# EAGLE design fpga (EAGLE 6.6.0)
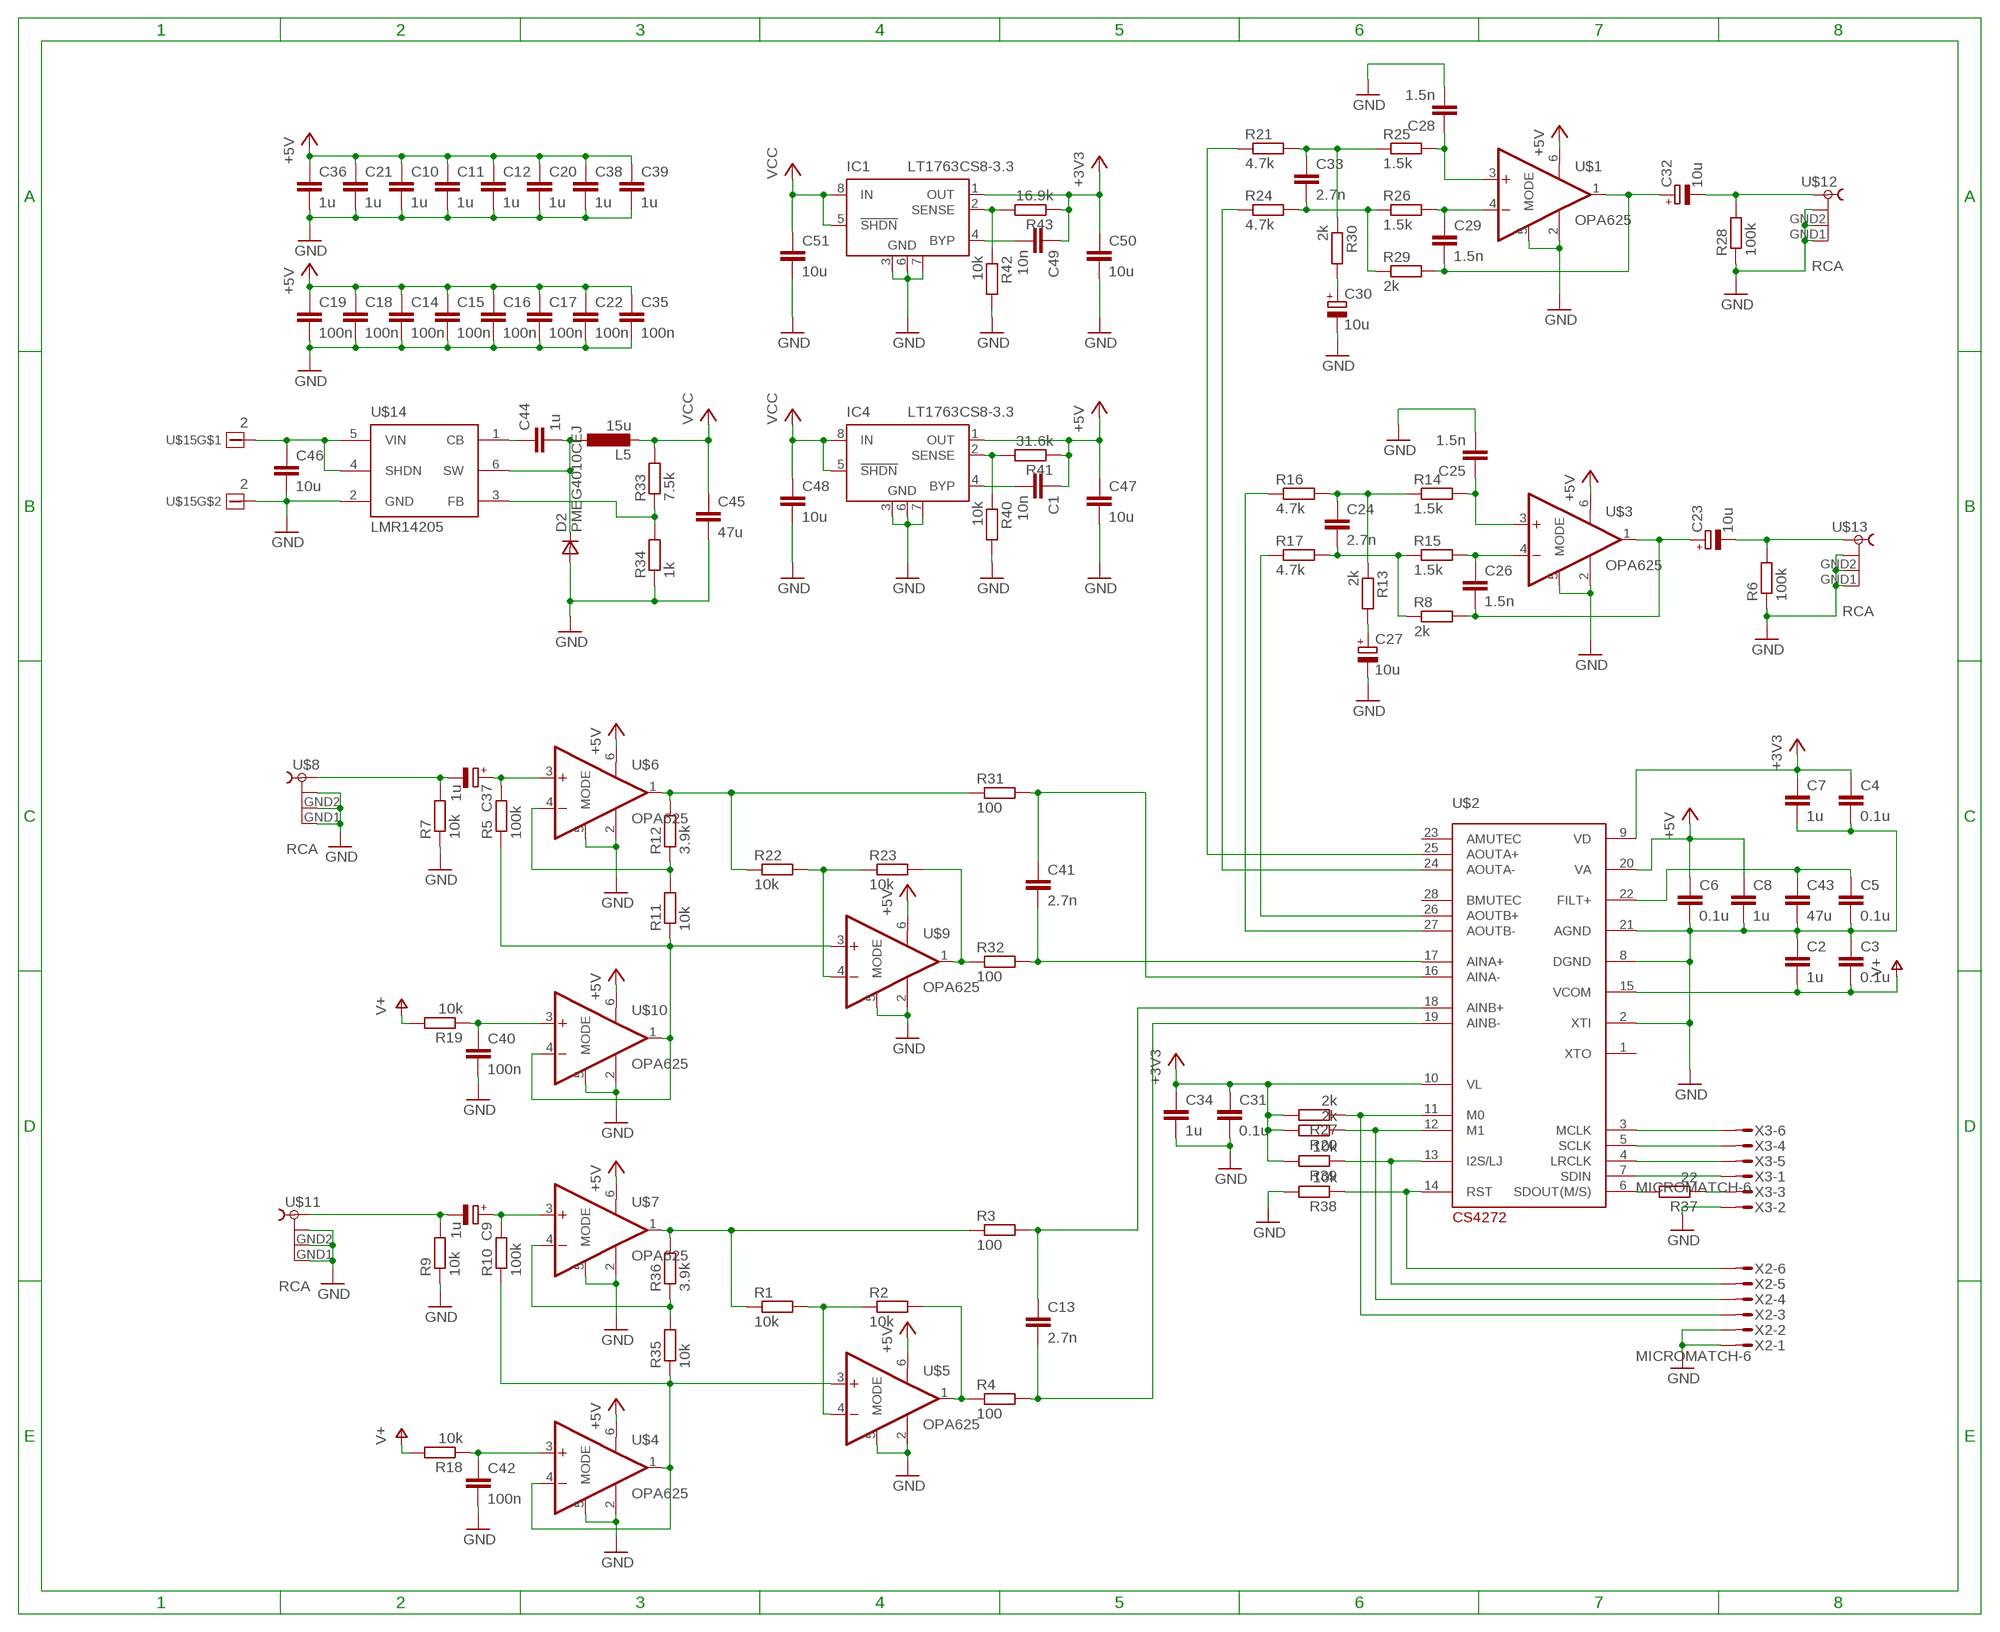
[diagram p0: schematic, sheet 1]

## Parts
C1  10n  C-EUC0603K  [C0603K]
C2  1u  C-EUC0603K  [C0603K]
C3  0.1u  C-EUC0603K  [C0603K]
C4  0.1u  C-EUC0603K  [C0603K]
C5  0.1u  C-EUC0603K  [C0603K]
C6  0.1u  C-EUC0603K  [C0603K]
C7  1u  C-EUC0603K  [C0603K]
C8  1u  C-EUC0603K  [C0603K]
C9  1u  CPOL-EU153CLV-0405  [153CLV-0405]
C10  1u  C-EUC0603K  [C0603K]
C11  1u  C-EUC0603K  [C0603K]
C12  1u  C-EUC0603K  [C0603K]
C13  2.7n  C-EUC0603K  [C0603K]
C14  100n  C-EUC0603K  [C0603K]
C15  100n  C-EUC0603K  [C0603K]
C16  100n  C-EUC0603K  [C0603K]
C17  100n  C-EUC0603K  [C0603K]
C18  100n  C-EUC0603K  [C0603K]
C19  100n  C-EUC0603K  [C0603K]
C20  1u  C-EUC0603K  [C0603K]
C21  1u  C-EUC0603K  [C0603K]
C22  100n  C-EUC0603K  [C0603K]
C23  10u  CPOL-EU153CLV-0405  [153CLV-0405]
C24  2.7n  C-EUC0603K  [C0603K]
C25  1.5n  C-EUC0603K  [C0603K]
C26  1.5n  C-EUC0603K  [C0603K]
C27  10u  CPOL-EU153CLV-0405  [153CLV-0405]
C28  1.5n  C-EUC0603K  [C0603K]
C29  1.5n  C-EUC0603K  [C0603K]
C30  10u  CPOL-EU153CLV-0405  [153CLV-0405]
C31  0.1u  C-EUC0603K  [C0603K]
C32  10u  CPOL-EU153CLV-0405  [153CLV-0405]
C33  2.7n  C-EUC0603K  [C0603K]
C34  1u  C-EUC0603K  [C0603K]
C35  100n  C-EUC0603K  [C0603K]
C36  1u  C-EUC0603K  [C0603K]
C37  1u  CPOL-EU153CLV-0405  [153CLV-0405]
C38  1u  C-EUC0603K  [C0603K]
C39  1u  C-EUC0603K  [C0603K]
C40  100n  C-EUC0603K  [C0603K]
C41  2.7n  C-EUC0603K  [C0603K]
C42  100n  C-EUC0603K  [C0603K]
C43  47u  C-EUC0805  [C0805]
C44  1u  C-EUC0603K  [C0603K]
C45  47u  C-EUC1206  [C1206]
C46  10u  C-EUC0805  [C0805]
C47  10u  C-EUC0603K  [C0603K]
C48  10u  C-EUC0603K  [C0603K]
C49  10n  C-EUC0603K  [C0603K]
C50  10u  C-EUC0603K  [C0603K]
C51  10u  C-EUC0603K  [C0603K]
D2  PMEG4010CEJ  DSOD323  [SOD323]
IC1  LT1763CS8-3.3  [SOIC8]
IC4  LT1763CS8-3.3  [SOIC8]
L5  15u  L-EU  [AAA]
R1  10k  R-EU_R0603  [R0603]
R2  10k  R-EU_R0603  [R0603]
R3  100  R-EU_R0603  [R0603]
R4  100  R-EU_R0603  [R0603]
R5  100k  R-EU_R0603  [R0603]
R6  100k  R-EU_R0603  [R0603]
R7  10k  R-EU_R0603  [R0603]
R8  2k  R-EU_R0603  [R0603]
R9  10k  R-EU_R0603  [R0603]
R10  100k  R-EU_R0603  [R0603]
R11  10k  R-EU_R0603  [R0603]
R12  3.9k  R-EU_R0603  [R0603]
R13  2k  R-EU_R0603  [R0603]
R14  1.5k  R-EU_R0603  [R0603]
R15  1.5k  R-EU_R0603  [R0603]
R16  4.7k  R-EU_R0603  [R0603]
R17  4.7k  R-EU_R0603  [R0603]
R18  10k  R-EU_R0603  [R0603]
R19  10k  R-EU_R0603  [R0603]
R20  2k  R-EU_R0603  [R0603]
R21  4.7k  R-EU_R0603  [R0603]
R22  10k  R-EU_R0603  [R0603]
R23  10k  R-EU_R0603  [R0603]
R24  4.7k  R-EU_R0603  [R0603]
R25  1.5k  R-EU_R0603  [R0603]
R26  1.5k  R-EU_R0603  [R0603]
R27  2k  R-EU_R0603  [R0603]
R28  100k  R-EU_R0603  [R0603]
R29  2k  R-EU_R0603  [R0603]
R30  2k  R-EU_R0603  [R0603]
R31  100  R-EU_R0603  [R0603]
R32  100  R-EU_R0603  [R0603]
R33  7.5k  R-EU_R0603  [R0603]
R34  1k  R-EU_R0603  [R0603]
R35  10k  R-EU_R0603  [R0603]
R36  3.9k  R-EU_R0603  [R0603]
R37  22  R-EU_R0603  [R0603]
R38  10k  R-EU_R0603  [R0603]
R39  10k  R-EU_R0603  [R0603]
R40  10k  R-EU_R0603  [R0603]
R41  31.6k  R-EU_R0603  [R0603]
R42  10k  R-EU_R0603  [R0603]
R43  16.9k  R-EU_R0603  [R0603]
U$1  OPA625  [SOT23-6]
U$2  CS4272  [TSSOP28]
U$3  OPA625  [SOT23-6]
U$4  OPA625  [SOT23-6]
U$5  OPA625  [SOT23-6]
U$6  OPA625  [SOT23-6]
U$7  OPA625  [SOT23-6]
U$8  RCA  [RCA]
U$9  OPA625  [SOT23-6]
U$10  OPA625  [SOT23-6]
U$11  RCA  [RCA]
U$12  RCA  [RCA]
U$13  RCA  [RCA]
U$14  LMR14205  [TSOT23-6_DDC]
U$15  2  [2]
X2  MICROMATCH-6  [MICROMATCH-6]
X3  MICROMATCH-6  [MICROMATCH-6]

## Nets
+3V3: C4.1 C7.1 C31.1 C34.1 C49.1 C50.1 IC1.1(OUT) R20.2 R27.2 R39.2 R43.1 U$2.9(VD) U$2.10(VL)
+5V: C1.1 C6.1 C8.1 C10.1 C11.1 C12.1 C14.1 C15.1 C16.1 C17.1 C18.1 C19.1 C20.1 C21.1 C22.1 C35.1 C36.1 C38.1 C39.1 C47.1 IC4.1(OUT) R41.1 U$1.6(V+) U$2.20(VA) U$3.6(V+) U$4.6(V+) U$5.6(V+) U$6.6(V+) U$7.6(V+) U$9.6(V+) U$10.6(V+)
GND: C2.1 C3.1 C4.2 C5.2 C6.2 C7.2 C8.2 C10.2 C11.2 C12.2 C14.2 C15.2 C16.2 C17.2 C18.2 C19.2 C20.2 C21.2 C22.2 C25.2 C27.- C28.2 C30.- C31.2 C34.2 C35.2 C36.2 C38.2 C39.2 C40.2 C42.2 C43.2 C45.2 C46.2 C47.2 C48.2 C50.2 C51.2 D2.2(A) IC1.3(GND) IC1.6(GND) IC1.7(GND) IC4.3(GND) IC4.6(GND) IC4.7(GND) R6.1 R7.1 R9.1 R28.1 R34.1 R38.2 R40.2 R42.2 U$1.2(V-) U$1.5(MODE) U$2.2(XTI) U$2.8(DGND) U$2.21(AGND) U$3.2(V-) U$3.5(MODE) U$4.2(V-) U$4.5(MODE) U$5.2(V-) U$5.5(MODE) U$6.2(V-) U$6.5(MODE) U$7.2(V-) U$7.5(MODE) U$8.GND1 U$8.GND2 U$8.GND3 U$9.2(V-) U$9.5(MODE) U$10.2(V-) U$10.5(MODE) U$11.GND1 U$11.GND2 U$11.GND3 U$12.GND1 U$12.GND2 U$12.GND3 U$13.GND1 U$13.GND2 U$13.GND3 U$14.2(GND) U$15.P$2 X2.1 X2.2 X3.2
N$1: R10.1 R35.1 U$4.1(OUT) U$4.4(-IN) U$5.3(+IN)
N$2: C9.+ R10.2 U$7.3(+IN)
N$3: R2.2 R4.1 U$5.1(OUT)
N$4: C5.1 C43.1 U$2.22(FILT+)
N$5: R1.2 R2.1 U$5.4(-IN)
N$6: C40.1 R19.1 U$10.3(+IN)
N$7: C24.1 R13.1 R14.1 R16.2
N$8: C13.1 R3.2 U$2.18(AINB+)
N$9: C13.2 R4.2 U$2.19(AINB-)
N$10: R12.2 R22.1 R31.1 U$6.1(OUT)
N$12: C24.2 R8.1 R15.1 R17.2
N$13: C37.- R7.2 U$8.S1
N$14: C9.- R9.2 U$11.S1
N$15: C25.1 R14.2 U$3.3(+IN)
N$16: C26.1 R15.2 U$3.4(-IN)
N$17: C23.+ C26.2 R8.2 U$3.1(OUT)
N$18: C23.- R6.2 U$13.S1
N$19: C27.+ R13.2
N$20: C30.+ R30.2
N$21: C42.1 R18.1 U$4.3(+IN)
N$23: IC1.2(SENSE) R42.1 R43.2
N$24: R17.1 U$2.26(AOUTB+)
N$25: R16.1 U$2.27(AOUTB-)
N$26: C49.2 IC1.4(BYP)
N$27: R24.1 U$2.24(AOUTA-)
N$28: R21.1 U$2.25(AOUTA+)
N$29: C33.1 R21.2 R25.1 R30.1
N$30: R11.2 R12.1 U$6.4(-IN)
N$32: C33.2 R24.2 R26.1 R29.1
N$33: C28.1 R25.2 U$1.3(+IN)
N$34: C29.1 R26.2 U$1.4(-IN)
N$35: C29.2 C32.+ R29.2 U$1.1(OUT)
N$36: R27.1 U$2.11(M0) X2.3
N$37: C41.2 R32.2 U$2.17(AINA+)
N$38: R1.1 R3.1 R36.2 U$7.1(OUT)
N$39: C32.- R28.2 U$12.S1
N$40: R20.1 U$2.12(M1) X2.4
N$41: C37.+ R5.2 U$6.3(+IN)
N$42: R35.2 R36.1 U$7.4(-IN)
N$43: C41.1 R31.2 U$2.16(AINA-)
N$44: R5.1 R11.1 U$9.3(+IN) U$10.1(OUT) U$10.4(-IN)
N$45: C44.1 U$14.1(CB)
N$46: R23.2 R32.1 U$9.1(OUT)
N$47: C44.2 D2.1(C) L5.P$1 U$14.6(SW)
N$48: R22.2 R23.1 U$9.4(-IN)
N$50: R33.1 R34.2 U$14.3(FB)
N$51: R38.1 U$2.14(RST) X2.6
N$52: R39.1 U$2.13(I2S/LJ) X2.5
N$53: U$2.3(MCLK) X3.6
N$54: U$2.5(SCLK) X3.4
N$55: U$2.4(LRCLK) X3.5
N$56: C46.1 U$14.4(SHDN) U$14.5(VIN) U$15.P$1
N$57: U$2.7(SDIN) X3.1
N$58: R37.2 U$2.6(SDOUT(M/S))
N$59: R37.1 X3.3
N$61: IC4.2(SENSE) R40.1 R41.2
N$64: C1.2 IC4.4(BYP)
V+: C2.2 C3.2 R18.2 R19.2 U$2.15(VCOM)
VCC: C45.1 C48.1 C51.1 IC1.5(!SHDN) IC1.8(IN) IC4.5(!SHDN) IC4.8(IN) L5.P$2 R33.2
Unconnected: U$2.1(XTO) U$2.23(AMUTEC) U$2.28(BMUTEC)

## Library data of the parts
C1-C8 C10-C22 C24-C26 C28 C29 C31 C33-C36 C38-C51 = rcl:C-EU: CAPACITOR, European symbol
C9 C23 C27 C30 C32 C37 = rcl:CPOL-EU: POLARIZED CAPACITOR, European symbol
D2 = zetex:D: DIODE; MPN: CDSOD323-T05C; OC_FARNELL: 1824860; OC_NEWARK: 79R6078
IC1 IC4 = linear-technology:LT1763CS8: 500mA, Low Noise, LDO Micropower Regulators Source: http://cds.linear.com/docs/Datasheet/1763ff.pdf; MPN: LT1763CS8-3.3; OC_FARNELL: 1273617; OC_NEWARK: 57M6055
L5 = rcl_COPY:L-EU: INDUCTOR, European symbol
R1-R43 = resistor:R-EU_: RESISTOR, European symbol
U$1 U$3-U$7 U$9 U$10 = linear2:OPA625
U$2 = analog-devices:CS4272
U$8 U$11-U$13 = con-hirschmann_copy:RCA
U$14 = texas_copy:LMR14205
U$15 = con-phoenix-3.81_copy:2
X2 X3 = con-amp-micromatch:MICROMATCH-6: MicroMaTch 6 7-215464-6 / 0-215464-6 Drawing Number C-215464 DDEController.pdf; MPN: 7-215464-6; OC_FARNELL: 3784630; OC_NEWARK: 19R8125

## Board
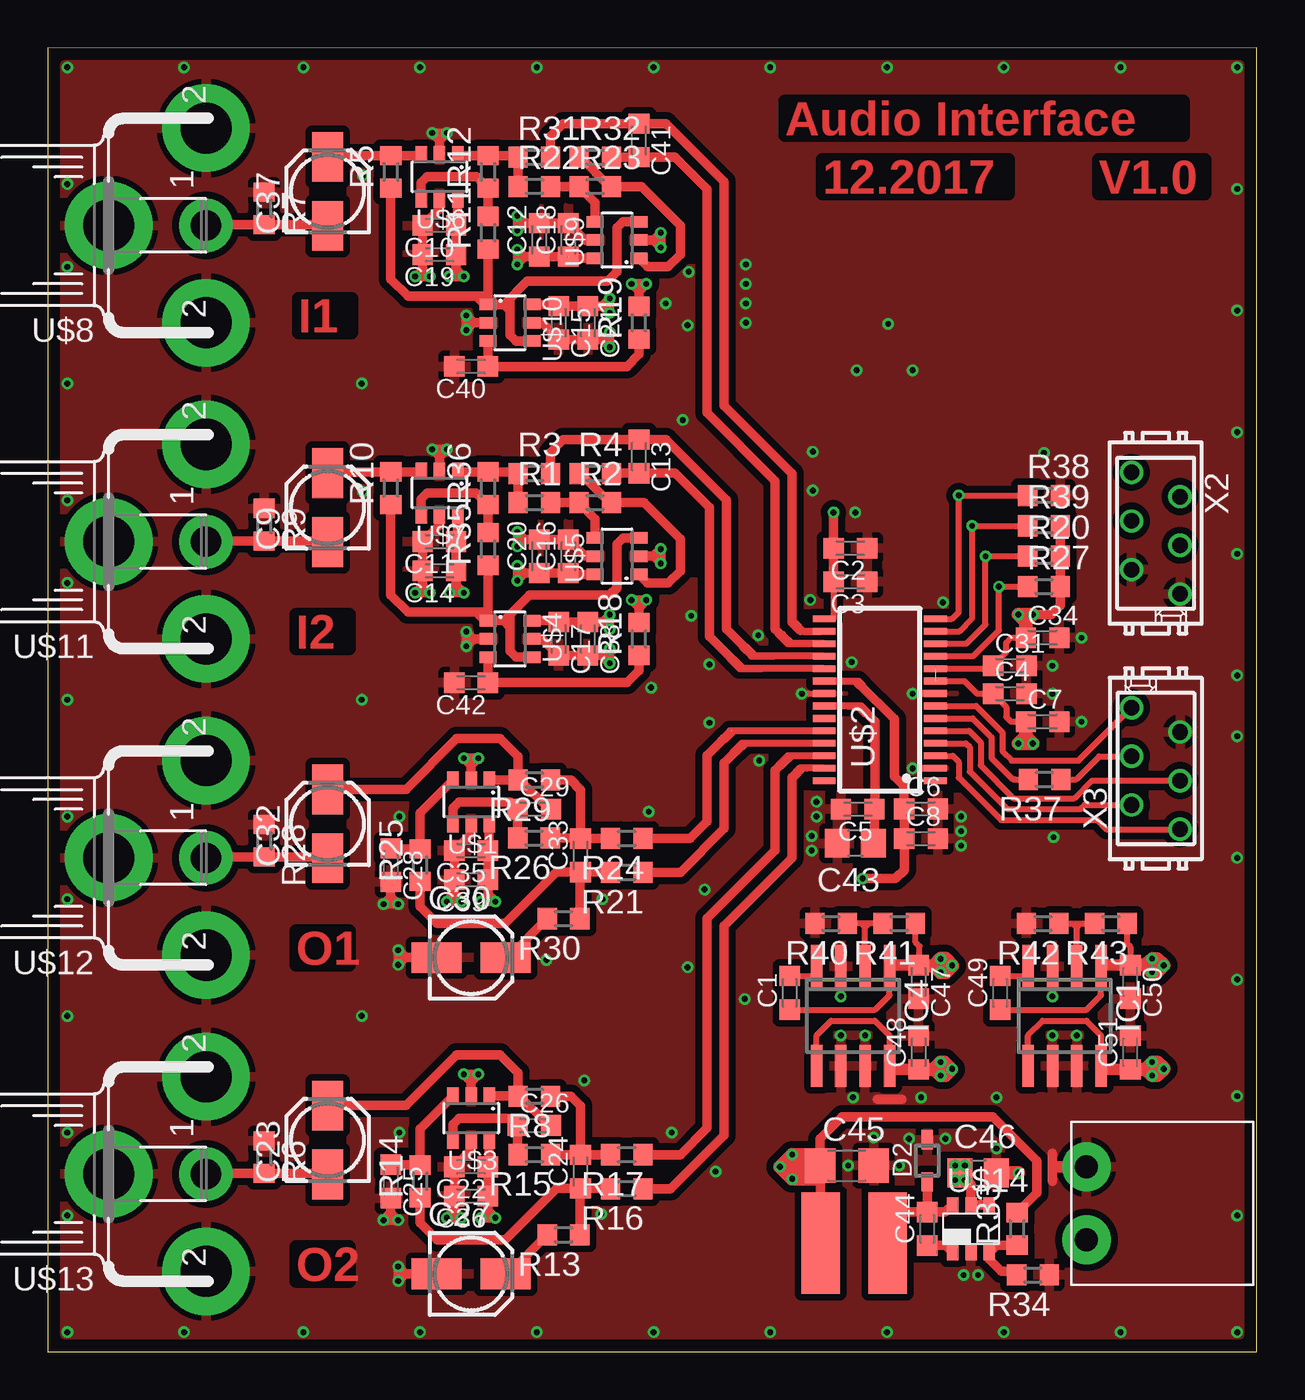
[diagram p1: board, top side]
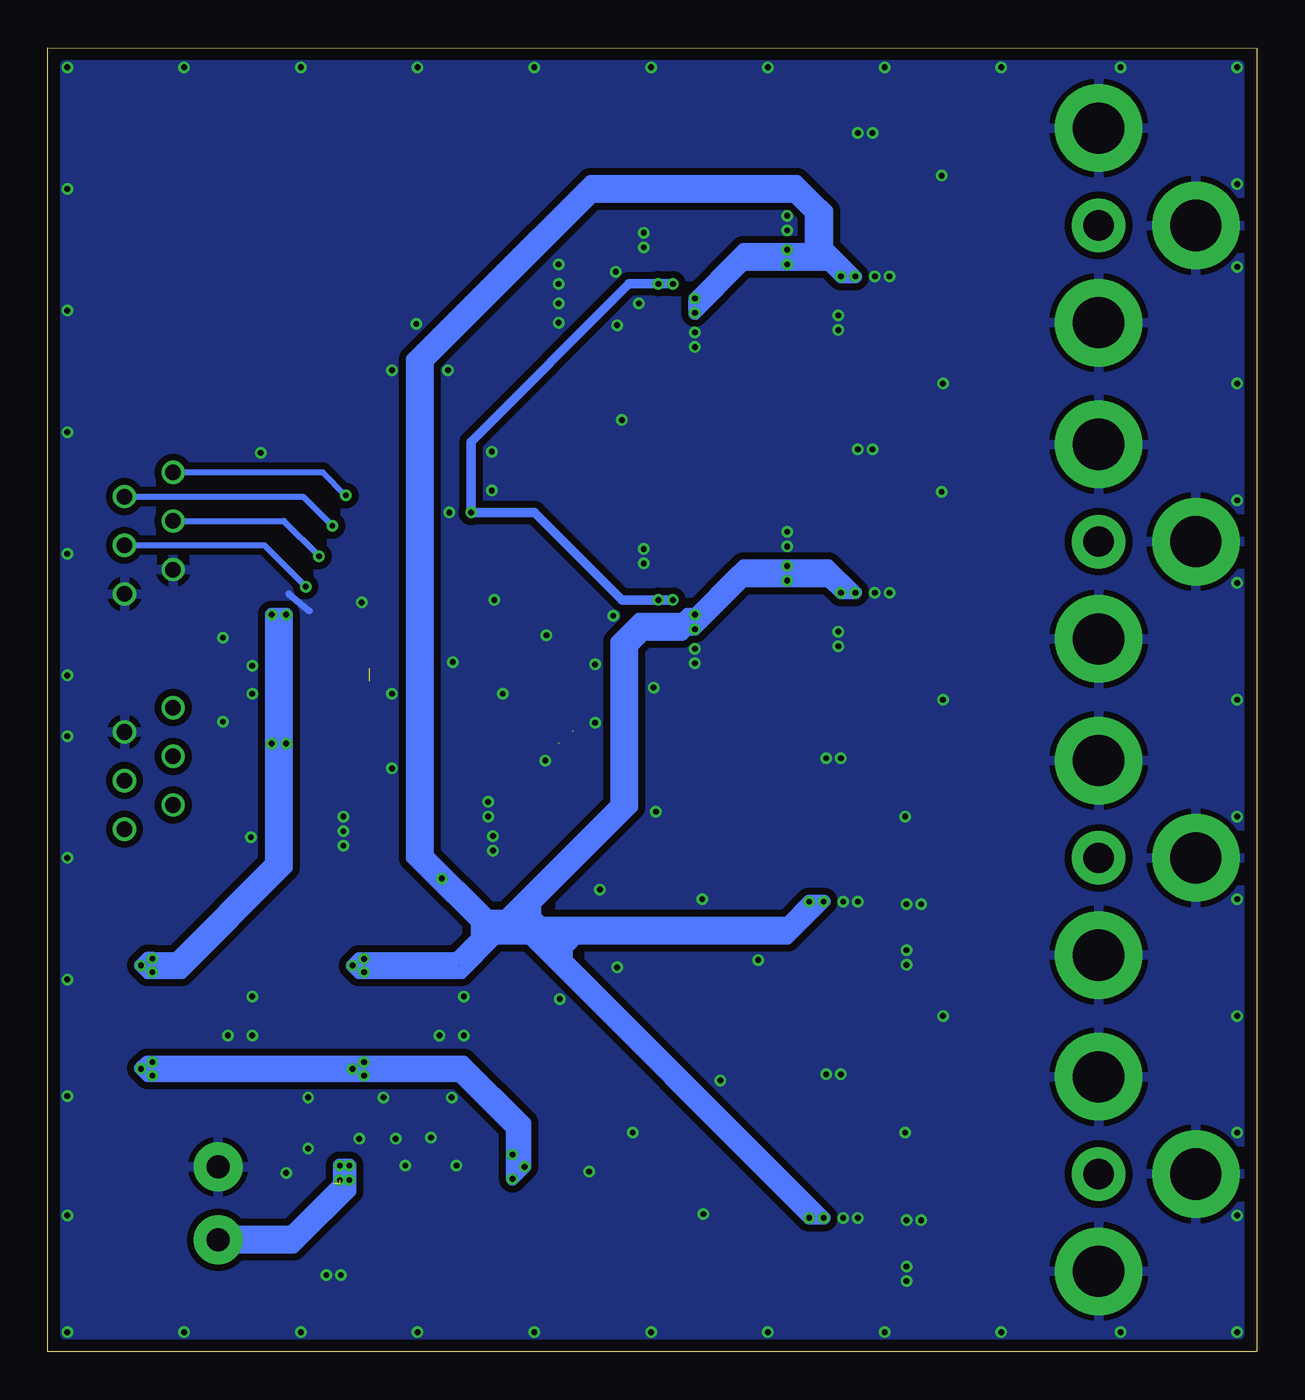
[diagram p2: board, bottom side, seen from below]

Size 63.12 x 68.07 mm. Coordinates in mm from the lower left corner, seen from the top.
Outline: 0,0 63.12,0 63.12,68.07 0,68.06 0,0
Copper layers (1*16): Top 0.035mm / dielectric 1.5mm / Bottom 0.035mm
Design rules "PCB-POOL Standard *": minimum track width 0.15mm, minimum drill 0.3mm, track to track 0.15mm, track to pad 0.15mm, pad to pad 0.15mm, via to via 0.15mm, smd to smd 0.15mm, copper to edge 0.3mm, drill to drill 0.2mm, minimum pad ring 0.2mm, minimum via ring 0.15mm, stop-mask expansion 0.075mm, vias tented up to drill 0.3mm, thermal gap 0.3mm
tRestrict: area 18.4,55.6 to 22.2,56.6; area 18.4,39.1 to 22.4,40.2; area 21,30.5 to 24.1,31.6; area 21,14 to 24.1,15; area 19.9,6.3 to 23.7,7.6; area 19.9,22.8 to 23.7,23.8; area 23.7,41.5 to 25.1,43.4; area 23.7,57.8 to 25.1,60; area 29,51.9 to 30.2,53.8; area 28.8,35.4 to 30.2,37.3; area 31.4,40.5 to 32.7,42.8; area 31.4,57 to 32.5,59.2; 2 more areas

### Footprints (pad centres in the part's own frame; a part is rotated, then mirrored left to right if it is on the bottom)
C0603K = smd 1.05 x 1.08: 1 -0.875,0; 2 0.875,0
153CLV-0405 = smd 2.6 x 1.6: + 1.8,0; - -1.8,0
C0805 = smd 1.3 x 1.5: 1 -0.95,0; 2 0.95,0
C1206 = smd 1.6 x 1.8: 1 -1.4,0; 2 1.4,0
SOD323 = smd 1 x 0.6: 1 -1.1,0; 2 1.1,0
SOIC8 = smd 0.6 x 2.2: 1 -1.905,-2.6; 2 -0.635,-2.6; 3 0.635,-2.6; 4 1.905,-2.6; 5 1.905,2.6; 6 0.635,2.6; 7 -0.635,2.6; 8 -1.905,2.6
AAA = smd 2 x 5.3: P$1 -2,1; P$2 1.5,1
R0603 = smd 1 x 1.1: 1 -0.85,0; 2 0.85,0
SOT23-6 = smd 0.6 x 0.9: 1 -0.95,-1.15; 2 0,-1.15; 3 0.95,-1.15; 4 0.95,1.15; 5 0,1.15; 6 -0.95,1.15
TSSOP28 = smd 0.35 x 1.2: 1 -4.225,-2.9; 2 -3.575,-2.9; 3 -2.925,-2.9; 4 -2.275,-2.9; 5 -1.625,-2.9; 6 -0.975,-2.9; 7 -0.325,-2.9; 8 0.325,-2.9; 9 0.975,-2.9; 10 1.625,-2.9; 11 2.275,-2.9; 12 2.925,-2.9; 13 3.575,-2.9; 14 4.225,-2.9; 15 4.225,2.9; 16 3.575,2.9; 17 2.925,2.9; 18 2.275,2.9; 19 1.625,2.9; 20 0.975,2.9; 21 0.325,2.9; 22 -0.325,2.9; 23 -0.975,2.9; 24 -1.625,2.9; 25 -2.275,2.9; 26 -2.925,2.9; 27 -3.575,2.9; 28 -4.225,2.9
RCA = drill 2.667 pad 4.572: GND1 -5.08,0; GND2 5.08,0; GND3 0,5.08 | drill 1.575 pad 2.794: S1 0,0
TSOT23-6_DDC = smd 0.6 x 0.8: 1 -0.95,-1.25; 2 0,-1.25; 3 0.95,-1.25; 4 0.95,1.25; 5 0,1.25; 6 -0.95,1.25
2 = drill 1.2 pad 2.54: P$1 -1.905,0; P$2 1.905,0
MICROMATCH-6 = drill 0.813: 1 3.175,1.27; 2 1.905,-1.27; 3 0.635,1.27; 4 -0.635,-1.27; 5 -1.905,1.27; 6 -3.175,-1.27

### Placement (x,y rotation side)
C1  38.73,18.73 90 top
C2  41.9,41.95 180 top
C3  41.9,40.2 180 top
C4  50.23,34.35 0 top
C5  42.29,28.32 180 top
C6  45.59,28.34 0 top
C7  51.94,32.89 0 top
C8  45.59,26.78 0 top
C9  14.61,44.07 90 top
C10  20.45,58.8 180 top
C11  20.45,42.29 180 top
C12  25.65,58.04 90 top
C13  30.86,46.74 270 top
C14  20.45,40.77 180 top
C15  26.67,53.72 270 top
C16  27.18,41.53 90 top
C17  26.67,37.21 270 top
C18  27.18,58.04 90 top
C19  20.45,57.28 180 top
C20  25.65,41.53 90 top
C21  28.19,53.72 270 top
C22  22.1,9.65 180 top
C23  14.61,11.05 90 top
C24  27.81,9.4 90 top
C25  17.91,8.89 270 top
C26  25.4,11.81 0 top
C27  22.1,4.06 0 top
C28  17.91,25.4 270 top
C29  25.4,28.32 0 top
C30  22.1,20.57 0 top
C31  50.23,35.81 0 top
C32  14.61,27.56 90 top
C33  27.81,25.91 90 top
C34  51.94,37.27 0 top
C35  22.1,26.16 180 top
C36  22.1,8.13 180 top
C37  14.61,60.58 90 top
C38  28.19,37.21 270 top
C39  22.1,24.64 180 top
C40  22.1,51.44 180 top
C41  30.86,63.25 270 top
C42  22.1,34.92 180 top
C43  42.16,26.54 180 top
C44  45.91,6.41 90 top
C45  41.72,9.72 0 top
C46  48.58,9.33 0 top
C47  45.47,19.3 270 top
C48  45.47,15.62 90 top
C49  49.72,18.73 90 top
C50  56.52,19.3 270 top
C51  56.52,15.62 90 top
D2  45.91,9.97 90 top
IC1  53.09,17.53 180 top
IC4  42.04,17.53 180 top
L5  41.85,6.67 180 top
R1  25.4,44.32 0 top
R2  28.57,44.32 0 top
R3  25.4,45.85 0 top
R4  28.57,45.85 0 top
R5  17.91,61.59 90 top
R6  11.3,10.16 270 top
R7  11.3,59.69 270 top
R8  25.4,13.33 180 top
R9  11.3,43.18 270 top
R10  17.91,45.09 90 top
R11  22.99,58.42 90 top
R12  22.99,61.59 90 top
R13  26.92,6.1 180 top
R14  19.43,8.89 90 top
R15  25.4,10.29 180 top
R16  30.23,8.51 180 top
R17  30.23,10.29 180 top
R18  30.86,37.21 90 top
R19  30.86,53.72 90 top
R20  52.01,41.53 0 top
R21  30.23,25.02 180 top
R22  25.4,60.83 0 top
R23  28.57,60.83 0 top
R24  30.23,26.8 180 top
R25  19.43,25.4 90 top
R26  25.38,26.81 180 top
R27  52.01,39.94 0 top
R28  11.3,26.67 270 top
R29  25.4,29.84 180 top
R30  26.92,22.61 180 top
R31  25.4,62.36 0 top
R32  28.57,62.36 0 top
R33  50.61,6.41 90 top
R34  51.43,4 180 top
R35  22.99,41.91 90 top
R36  22.99,45.09 90 top
R37  52.04,29.88 180 top
R38  52.01,44.7 0 top
R39  52.01,43.12 0 top
R40  40.89,22.35 180 top
R41  44.45,22.35 180 top
R42  51.94,22.35 180 top
R43  55.5,22.35 180 top
U$1  22.1,28.7 180 top
U$2  43.43,34.04 90 top
U$3  22.1,12.19 180 top
U$4  24.13,37.21 270 top
U$5  29.72,41.53 90 top
U$6  20.45,61.34 180 top
U$7  20.45,44.83 180 top
U$8  8.26,58.8 90 top
U$9  29.72,58.04 90 top
U$10  24.13,53.72 270 top
U$11  8.26,42.29 90 top
U$12  8.26,25.78 90 top
U$13  8.26,9.27 90 top
U$14  48.2,6.41 0 top
U$15  54.23,7.75 90 top
X2  57.85,42.74 270 top
X3  57.85,30.45 90 top

### Tracks (layer width: path | path; a pad name or v marks a point on that pad's centre or on a via)
+3V3  (via drill 0.3)  (2 unrouted)
  Top 0.305: U$2.10 49.2,35.66 C31.1 49.35,35.83 50.04,36.51 50.04,37.02 50.29,37.27 C34.1 | U$2.9 47.86,35.01 48.51,34.35 C4.1 50.04,33.67 50.04,33.15 50.29,32.89 C7.1 | 56.46,19.87 C50.1 | IC1.1 54.99,18.61 54.23,17.84 49.72,17.84 C49.1 | R43.1 56.35,21.31 56.52,21.14 C50.1 | 56.58,19.92 C50.1
  Top 0.508: R39.2 R20.2 R27.2 52.86,38.95 52.39,38.48 v51.43,38.48
  Top 0.61: IC1.1 arc-90 55.04,20.18 C50.1
  Top 0.711: 57.26,20.18 v57.66,20.52 v57.66,20.51 | 57.26,20.18 C50.1 | v57.66,19.81 57.29,20.18 57.26,20.18 | v57.66,20.51 v57.66,19.81 | 51.07,38.11 v51.43,38.48 v50.67,38.48 51.04,38.11 51.07,38.11 | 51.07,38.11 C34.1 | v57.66,20.51 57.91,20.51 v58.26,20.16 57.91,19.81 v57.66,19.81 | v50.67,31.75 51.07,32.14 C7.1 51.07,32.12 v51.43,31.75 v50.67,31.75
  Bottom 0.711: v57.66,20.52 56.42,20.52 51.43,25.53 v51.43,38.48 51.05,38.48 | 51.05,38.48 v50.67,38.48 50.67,25.27 56.13,19.81 v57.66,19.81 | v57.66,19.81 v57.66,20.52 | v57.66,20.52 57.28,20.19 56.26,20.19 51.05,25.4 51.05,38.48 | v57.66,20.52 57.92,20.52 58.26,20.18 57.9,19.81 v57.66,19.81
+5V  (via drill 0.3, 0.3 pad 0.3)  (2 unrouted)
  Top 0.025: 42.24,35.05 42.2,35.01 42.13,35.01 42.07,34.96 | 42.24,35.05 42.24,35.06 | 42.31,34.91 42.24,34.98 42.24,35.05
  Top 0.254: 41.98,35.06 42.24,35.06 42.33,35.06 42.59,34.81 | 41.72,34.96 42.07,34.96 42.33,34.7
  Top 0.305: 43.94,19.94 IC4.1 43.94,18.61 43.18,17.84 38.73,17.84 C1.1 39.04,17.84 | 45.52,22.14 R41.1 45.3,21.38 45.52,21.16 45.52,20.18 | 46.86,20.52 v46.62,20.52 v46.61,20.51
  Top 0.356: U$2.20 42.2,35.01
  Top 0.508: U$6.6 21.4,58.88 C10.1 C19.1 21.32,56.53 | U$7.6 21.4,42.37 C11.1 C14.1 21.32,40.02 | 27.28,40.71 C16.1 | 25.68,40.82 C20.1 | U$10.6 26.6,54.67 C15.1 C21.1 28.94,54.6 | U$4.6 26.6,38.16 C17.1 C38.1 28.97,38.09 | 21.32,56.53 v21.72,56.13 v20.96,56.13 20.96,56.16 21.32,56.53 | 21.32,40.02 v21.72,39.62 v20.96,39.62 20.96,39.65 21.32,40.02 | C16.1 C20.1 | U$5.6 27.25,40.58 C16.1 | C20.1 24.88,40.65 | 24.88,40.65 v24.51,41.02 v24.51,40.26 24.51,40.29 24.88,40.65 | 24.88,57.16 C12.1 C18.1 27.25,57.09 U$9.6 | 24.88,57.16 v24.51,57.53 v24.51,56.77 24.51,56.8 24.88,57.16 | 28.97,38.09 v29.34,37.72 v29.34,38.48 29.34,38.45 28.97,38.09 | 28.94,54.6 v29.34,54.99 v29.34,54.23 29.31,54.23 28.94,54.6 | U$1.6 23.05,26.24 C35.1 C39.1 22.97,23.89 | 22.97,23.89 v23.37,23.49 v22.61,23.49 22.97,23.86 22.97,23.89 | U$3.6 23.05,9.73 C22.1 C36.1 22.97,7.38 | 22.97,7.38 v23.37,6.99 v22.61,6.99 22.61,7.01 22.97,7.38 | v42.54,24.7 44.26,24.7 44.71,25.15 C8.1 C6.1 44.7,28.34 44.7,29.53 44.2,30.04 44.2,33.02 42.31,34.91
  Top 0.61: IC4.1 43.99,20.18 C47.1
  Top 0.711: 46.26,20.15 46.63,20.52 46.86,20.52 47.23,20.15 46.89,19.81 v46.6,19.81 46.26,20.15 | 46.26,20.15 45.54,20.15 45.52,20.18 C47.1
  Bottom 0.356: 40.39,22.73 40.83,22.73 40.83,22.29 | 43.43,25.78 43.52,25.78 43.52,25.73
  Bottom 0.406: 35.94,21.21 37.78,21.21 37.78,22.1 | 33.4,28.57 33.4,28.51 33.02,28.51 33.02,28.57 | 32.38,37.34 32.26,37.34 32.26,37.46 | 40.83,22.29 40.83,21.72
  Bottom 0.508: 43.43,26.03 43.69,26.29 43.69,51.69 43.69,51.82 | 43.31,25.91 43.43,26.03 | 43.43,26.03 43.81,26.03 43.52,25.73 v42.54,24.7 | 43.43,25.78 43.43,25.65 41.66,23.88
  Bottom 0.711: v29.34,38.48 26.8,41.02 v24.51,41.02 22.35,41.02 v20.96,39.62 v21.72,39.62 | v29.34,37.72 26.8,40.26 22.35,40.26 v21.72,39.62 | v21.72,39.62 22.73,40.64 C16.1 v29.34,38.48 | v29.34,54.99 26.8,57.53 23.24,57.53 | 23.24,57.53 22.35,57.53 v20.96,56.13 | v20.96,56.13 v21.72,56.13 22.35,56.77 26.8,56.77 v29.34,54.23 v29.34,54.99 | v20.96,56.13 21.98,57.16 27.16,57.16 v29.34,54.99 | v29.34,37.72 v29.34,38.48 | v29.34,38.48 29.72,38.48 29.97,38.23 32.26,38.23 | 32.26,38.23 32.26,37.85 | 32,37.46 32.26,37.46 32.26,37.85 | 32,37.46 29.97,37.46 29.72,37.72 v29.34,37.72 | v29.34,37.72 29.46,37.85 32.26,37.85 | 23.24,59.44 24.13,60.32 34.67,60.32 43.31,51.69 43.31,25.91 40.04,22.64 | 23.11,59.44 23.11,60.2 | 23.62,60.71 24,61.09 34.8,61.09 40.26,55.63 | 40.26,55.63 39.75,55.63 34.67,60.71 23.62,60.71 | 23.62,60.71 23.11,60.2 | 23.11,60.2 22.48,59.56 22.48,58.29 | 22.48,58.29 22.86,58.29 | 23.24,58.29 23.24,59.44 | 23.24,59.44 23.11,59.44 | 23.11,59.44 22.86,59.44 22.86,58.29 | 22.86,58.29 23.24,58.29 | 23.24,58.29 23.24,57.53 | 22.48,58.29 22.48,57.66 22.86,57.66 22.86,58.04 | 37.97,21.59 v23.37,6.99 v22.61,6.99 37.97,22.35 | 37.97,21.59 38.1,21.59 | 38.1,21.59 39.62,21.59 | 39.62,21.59 39.62,21.97 | 37.97,22.35 37.97,21.97 | 39.62,22.35 37.97,22.35 | 39.62,22.35 39.62,22.22 | 39.62,22.22 39.62,21.97 | 39.62,21.97 38.35,21.97 | 37.34,22.35 24.51,22.35 v23.37,23.49 v22.61,23.49 24.51,21.59 37.97,21.59 | 37.34,22.35 37.97,22.35 | 38.1,21.59 38.1,21.97 37.97,22.1 37.78,22.1 24.77,22.1 | 32.26,38.23 33.4,37.08 33.4,28.57 39.24,22.73 | 39.24,22.73 39.62,22.35 | 32,37.46 32.89,36.58 | 40.04,22.64 39.62,22.22 | 40.26,55.63 44.07,51.82 44.07,25.78 39.88,21.59 39.75,21.59
  Bottom 0.711: 39.75,21.59 39.62,21.59 | 37.97,22.86 37.85,22.86 37.34,22.35 | 39.24,22.73 40.39,22.73 | v46.61,19.81 41.53,19.81 39.75,21.59 | 40.04,22.64 40.04,22.26 41.78,20.51 v46.61,20.51 46.86,20.51 v47.21,20.16 | 32.38,37.34 32.64,37.08 32.64,28.45 37.72,23.37 | 37.72,23.37 38.48,22.61 | 37.72,23.37 37.72,22.61 | 35.56,21.59 35.94,21.21 36.07,21.08 | 36.07,21.08 36.32,20.83 | 36.07,21.08 36.07,20.32 | 47.2,20.15 46.86,19.81 v46.6,19.81 | 33.02,36.96 33.02,28.57 | 43.69,51.69 43.69,25.91
GND  (via drill 0.3, 0.3 pad 0.3)
  Top 0.305: v39.37,34.35 U$2.21 | U$2.8 | v45.15,34.35 46.29,34.35 | v41.4,18.54 IC4.3
  Top 0.356: v45.15,30.45 v45.16,30.46 U$2.2 | U$2.8 v45.15,34.36 v45.15,34.35
  Top 0.508: U$7.5 20.45,43.17 C11.2 C14.2 19.57,39.99 | U$6.5 20.45,59.68 C10.2 C19.2 19.57,56.5 | 25.68,42.57 C20.2 | U$9.5 28.05,58.04 C18.2 C12.2 24.91,58.91 | U$4.5 25.8,37.21 C17.2 C38.2 | U$10.5 25.8,53.72 C15.2 C21.2 | 20.45,46.74 v20.07,47.12 v20.83,47.12 20.45,46.74 | U$7.2 20.45,46.74 | 20.45,63.25 v20.83,63.63 v20.07,63.63 20.45,63.25 | U$6.2 20.45,63.25 | 19.57,56.5 v19.94,56.13 v19.18,56.13 19.21,56.13 19.57,56.5 | 19.57,39.99 v19.94,39.62 v19.18,39.62 19.21,39.62 19.57,39.99 | C20.2 C16.2 28.05,41.53 U$5.5 | C20.2 24.91,42.4 | 24.91,42.4 v24.51,42.8 v24.51,42.04 24.54,42.04 24.91,42.4 | 24.91,58.91 v24.51,59.31 v24.51,58.55 24.54,58.55 24.91,58.91 | U$9.2 31.62,58.04 | 31.62,58.04 v32,57.66 v32,58.42 31.62,58.04 | 31.62,41.53 v32,41.91 v32,41.15 31.62,41.53 | U$5.2 31.62,41.53 | C38.2 28.97,36.34 v29.34,36.7 v29.34,35.94 28.94,36.34 C38.2 | U$4.2 22.23,37.21 | 22.23,37.21 v21.84,37.59 v21.84,36.83 22.23,37.21 | C21.2 28.97,52.85 v29.34,53.21 v29.34,52.45 28.94,52.85 C21.2 | U$10.2 22.23,53.72 | 22.23,53.72 v21.84,54.1 v21.84,53.34 22.23,53.72 | U$1.2 22.1,30.61 | 22.1,30.61 v21.72,30.99 v22.48,30.99 22.1,30.61 | U$1.5 22.1,27.04 C35.2 C39.2 | C39.2 21.22,23.86 v21.59,23.49 v20.83,23.49 21.22,23.89 C39.2 | C28.2 17.91,23.75 | 17.91,23.75 v17.53,23.37 v18.29,23.37 17.91,23.75 | 18.67,20.57 v18.29,20.95 v18.29,20.19 18.67,20.57 | 18.67,20.57 C30.- | 17.91,7.24 v18.29,6.86 v17.53,6.86 17.91,7.24 | 17.91,7.24 C25.2 | U$3.2 22.1,14.1 | 22.1,14.1 v21.72,14.48 v22.48,14.48 22.1,14.1 | C36.2 21.22,7.38 v20.83,6.99 v21.59,6.99 21.22,7.35 C36.2 | C36.2 C22.2 22.1,10.53 U$3.5 | C27.- 18.67,4.06 | 18.67,4.06 v18.29,4.44 v18.29,3.68 18.67,4.06
  Top 0.508: 52.45,10.35 52.45,8.89 | 44.59,13.17 43.32,13.17
  Top 0.61: 54.16,9.65 52.52,9.65
  Top 0.711: v50.67,9.33 C46.2
  Bottom 0.356: 49.47,38.67 50.55,39.56
  other vias: 16.38,50.55 1.02,50.55 31.62,67.06 25.53,67.06 19.43,67.06 13.34,67.06 1.02,67.06 7.11,67.06 16.38,34.04 1.02,34.04 1.02,44.45 1.02,40.13 1.02,60.96 1.02,23.62 1.02,11.43 1.02,56.64 1.02,27.94 1.02,7.11 34.29,24.13 33.15,48.64 33.4,20.07 16.38,17.53 1.02,17.53 31.62,1.02 25.53,1.02 19.43,1.02 13.34,1.02 1.02,1.02 7.11,1.02 43.81,1.02 43.81,67.06 37.72,1.02 37.72,67.06 49.91,67.06 49.91,1.02 40.13,27.94 39.88,26.92 47.69,27.94 47.69,26.42 40.13,28.7 39.88,26.16 47.69,27.18 41.97,36 39.81,39.24 42.16,43.81 37.08,37.4 37.15,30.86 33.46,56.39 36.45,53.72 36.45,54.74 36.45,55.75 36.45,56.77 32.26,54.74 33.4,53.59 39.94,44.96 39.94,46.99 31.5,34.67 33.59,38.42 49.53,10.6 44.45,9.72 43.12,11.18 44.96,11.11 46.86,11.11 41.78,9.72 47.82,4 48.58,4 56.01,1.02 62.1,1.02 56.01,67.06 62.1,67.06 62.1,7.11 62.1,13.33 62.1,19.43 62.1,35.31 62.1,41.66 62.1,32.13 62.1,25.78 62.1,54.36 62.1,48.01 62.1,60.71 41.4,16.51 42.67,16.51 52.45,18.54 52.45,16.51 53.72,16.51 53.97,32.89 53.97,37.27 52.45,34.35 52.45,35.81 42.23,51.24 43.88,53.66 45.15,51.24 46.74,39.12 52.51,26.86 32.58,11.43 28,14.16 36.39,18.41 34.86,9.4 34.54,35.88 34.54,32.83 31.37,28.19 16.45,44.89 16.45,61.4 18.35,27.94 18.35,11.43 52.01,46.93 49.53,13.27 45.59,13.27 42.04,13.27 26.04,20.45 28.89,7.18 28.96,23.62
  pour Top (isolate 0.356): 0.89,67.18 62.23,67.18 62.23,0.89 0.89,0.89
  pour Bottom (isolate 0.356): 0.89,67.18 62.23,67.18 62.23,0.89 0.89,0.89
N$1
  Top 0.508: R10.1 17.91,39.5 18.8,38.61 22.23,38.61 22.35,38.61 | U$4.1 23.82,38.16 | 23.82,38.16 24.13,37.85 | U$4.4 24.45,36.26 24.13,36.58 24.13,37.85 | R35.1 U$4.1 | 22.35,38.61 22.8,38.16 U$4.1 | U$5.3 30.03,42.48 29.72,42.16 29.72,39.88 29.34,39.5 25.15,39.5 23.82,38.16 | 24.13,37.85 24.13,38.48 | 22.35,38.61 22.92,38.61
N$2
  Top 0.508: C9.+ 14.67,45.94 R10.2 19.45,45.94 U$7.3
N$3
  Top 0.508: R4.1 27.81,45.85 29.34,44.32 R2.2 31.11,44.32 33.02,42.42 33.02,40.77 32.38,40.13 31.32,40.13 U$5.1
N$4
  Top 0.127: 42.25,33.71 42.29,33.71 | 42.29,33.71 | 42.69,33.28 42.69,33.29 42.73,33.34 | 42.35,33.71 42.37,33.71 | 42.37,33.71
  Top 0.356: 42.35,33.71 U$2.22 | 41.74,33.71 42.25,33.71 42.69,33.28 | 42.11,33.71 42.29,33.71 42.37,33.71 42.47,33.71 42.82,33.36
  Top 0.508: 43.17,26.73 C43.1 43.17,26.59 C5.1 43.17,32.9 42.73,33.34
N$5
  Top 0.508: R1.2 R2.1 28.57,43.48 U$5.4
N$6
  Top 0.508: U$10.3 22.98,51.44 C40.1 30.23,51.44 30.86,52.07 R19.1
N$7
  Top 0.508: R16.2 29.36,8.52 C24.1 | C24.1 27.77,8.48 R13.1 | C24.1 26.56,8.52 23.88,5.84 20.32,5.84 19.43,6.73 R14.1
N$8
  Top 0.254: 36.84,36.31 | 36.45,36.7 36.45,36.77 36.47,36.79
  Top 0.356: U$2.18 36.84,36.31 36.45,36.7 | 36.47,36.79 36.95,36.31 37.89,36.31 | 36.25,36.79 36.74,36.31 36.84,36.31 37.68,36.31
  Top 0.508: 26.29,46.01 R3.2 26.25,46.95 26.91,47.61 C13.1 32.27,47.61 35.43,44.45 35.43,37.72 36.45,36.7
N$9
  Top 0.254: 35.81,36.07 35.81,36.06 | 35.81,36.06 35.77,36.01 | 35.85,36.14 35.85,36.09 35.81,36.06
  Top 0.356: U$2.19 36.22,35.66 35.81,36.07 | 35.85,36.14 36.33,35.66 37.27,35.66 | 35.64,36.14 35.77,36.01 36.12,35.66 37.06,35.66
  Top 0.508: C13.2 30.85,45.97 | R4.2 29.44,45.86 C13.2 | C13.2 32.75,45.86 34.54,44.07 34.54,37.34 35.81,36.07
N$10
  Top 0.508: U$6.1 21.44,62.45 R12.2 24.46,62.45 R31.1 R22.1
N$12
  Top 0.508: R8.1 27.3,13.33 27.81,12.83 C24.2 | R15.1 26.26,10.27 C24.2 | R17.2 29.36,10.27 C24.2
N$13
  Top 0.508: U$8.S1 8.29,58.84 R7.2 14.54,58.84 C37.-
N$14
  Top 0.508: U$11.S1 8.29,42.33 R9.2 14.54,42.33 C9.-
N$15
  Top 0.508: C25.1 19.41,9.77 R14.2 19.43,11.62 U$3.3
N$16
  Top 0.508: R15.2 24.53,10.31 C26.1 24.14,12.19 21.46,12.19 21.15,11.88 U$3.4
N$17
  Top 0.508: U$3.1 R8.2 | R8.2 24.64,13.33 26.16,11.81 C26.2 | C23.+ 18.69,12.85 21.34,15.49 23.62,15.49 24.55,14.57 R8.2
N$18
  Top 0.508: U$13.S1 8.29,9.31 R6.2 14.54,9.31 C23.-
N$19
  Top 0.508: R13.2 24.04,4.06 C27.+
N$20
  Top 0.508: 23.94,20.61 C30.+ 24.04,20.57 R30.2
N$21
  Top 0.508: U$4.3 C42.1 30.23,34.92 30.86,35.56 R18.1
N$22
  Bottom 0.406: 33.34,28.57 32.96,28.57
N$23
  Top 0.305: R42.1 53.53,22.35 | 53.53,22.35 53.72,22.35 | 53.72,22.35 53.91,22.35 | 53.91,22.35 R43.2 | IC1.2 53.72,22.16 | 53.72,22.16 53.72,22.35 | 53.72,22.16 53.91,22.35 | 53.72,22.16 53.53,22.35
N$24
  Top 0.305: 38.84,31.11 38.87,31.11 38.88,31.11
  Top 0.356: U$2.26 38.88,31.11 38.73,31.11 38.23,30.61 | 38.84,31.11 39.34,31.11 39.55,31.11 | 38.84,31.11 38.62,31.11 38.15,30.64 | 38.84,31.11 38.37,30.64
  Top 0.508: R17.1 33.02,10.29 34.42,11.68 34.42,22.61 37.97,26.16 37.97,30.35 38.23,30.61 38.48,30.86
N$25
  Top 0.305: 39.46,30.46 39.47,30.46 | 39.25,30.46 39.26,30.46 39.31,30.42
  Top 0.356: U$2.27 39.47,30.46 39.35,30.46 39.31,30.42 39.12,30.23 | 40.17,30.46 39.46,30.46 38.99,29.99 | 39.63,30.46 39.25,30.46 38.86,30.08
  Top 0.508: R16.1 32.51,8.51 35.31,11.3 35.31,22.22 38.86,25.78 38.86,29.97 39.12,30.23
N$26
  Top 0.305: 49.77,19.29 C49.2 51.18,19.61 IC1.4
N$27  (1 unrouted)
  Top 0.305: 35.35,31.94 35.35,31.96 35.31,32 | 35.71,32.41 35.74,32.41 | 36.14,32.41 35.7,32.41 | 35.7,32.41 35.68,32.39 35.66,32.39 35.43,32.16 35.44,32.16 35.46,32.17 35.47,32.17 35.7,32.39 35.7,32.4 35.68,32.41 35.67,32.41 35.52,32.27 | 35.44,32.17 35.44,32.18 35.69,32.42 35.67,32.42 | 35.67,32.42 35.52,32.27 | 35.7,32.41 35.69,32.41 35.67,32.42
  Top 0.356: U$2.24 35.71,32.41 35.31,32 | 36.32,32.41 35.74,32.41 35.61,32.41 35.13,31.94 | 36.53,32.41 35.82,32.41 35.35,31.94
  Top 0.508: R24.1 33.53,26.8 34.42,27.69 34.42,31.12 35.31,32
N$28  (1 unrouted)
  Top 0.305: 35.97,31.29 35.97,31.32 35.93,31.36 | 36.33,31.76 36.4,31.76 | 36.3,31.76 36.46,31.76 | 36.46,31.76 36.76,31.76 36.77,31.76 36.75,31.76 | 36.06,31.52 36.08,31.52 36.31,31.75 36.31,31.76 36.32,31.76 36.46,31.76
  Top 0.356: U$2.25 36.33,31.76 35.93,31.36 | 36.94,31.76 36.4,31.76 36.22,31.76 35.75,31.29 | 37.15,31.76 36.44,31.76 35.97,31.29
  Top 0.508: R21.1 33.02,25.02 35.31,27.3 35.31,30.73 35.93,31.36 35.94,31.37
N$29
  Top 0.508: R25.1 19.43,23.24 20.32,22.35 23.88,22.35 26.56,25.03 C33.1 | R21.2 29.36,25.03 C33.1 | C33.1 27.77,24.99 R30.1
N$30
  Top 0.508: R11.2 R12.1 22.39,61.34 19.81,61.34 19.5,61.03 U$6.4
N$32
  Top 0.508: R29.1 27.3,29.84 27.81,29.34 C33.2 | R24.2 29.36,26.78 C33.2 | C33.2 27.78,26.81 R26.1
N$33
  Top 0.508: U$1.3 19.43,28.13 R25.2 17.93,26.25 C28.1
N$34
  Top 0.508: U$1.4 21.15,28.39 21.46,28.7 24.14,28.7 C29.1 24.53,26.82 R26.2
N$35
  Top 0.508: R29.2 24.64,29.84 26.16,28.32 C29.2 | U$1.1 R29.2 | 14.65,29.89 C32.+ 18.69,29.36 21.34,32 23.62,32 24.55,31.08 R29.2
N$36  (via drill 0.3)
  Top 0.305: U$2.11 48.31,36.31 49.66,37.66 v49.66,39.94 R27.1
  Bottom 0.305: X2.3 51.82,42.1 v49.66,39.94
N$37
  Top 0.356: U$2.17 38.75,36.96 | 39.78,36.96 38.84,36.96 38.36,37.45 38.36,37.34 38.35,37.34 38.73,36.96 38.75,36.96 | 38.15,37.45 38.63,36.96 38.75,36.96 | 38.75,36.96 39.57,36.96 | 38.75,36.96
  Top 0.508: R32.2 30.85,62.36 C41.2 32.75,62.37 34.42,60.71 34.42,49.02 37.97,45.47 37.97,37.72 38.35,37.34
N$38
  Top 0.508: U$7.1 21.44,45.94 R36.2 24.46,45.94 R3.1 | 24.51,45.94 R3.1 | R3.1 R1.1
N$39
  Top 0.508: U$12.S1 8.29,25.82 R28.2 14.54,25.82 C32.- 14.59,25.82
N$40  (via drill 0.3)
  Top 0.305: U$2.12 47.95,36.96 48.96,37.97 v48.96,41.53 R20.1
  Bottom 0.305: X2.4 50.8,43.37 v48.96,41.53
N$41
  Top 0.508: C37.+ 14.67,62.45 R5.2 19.45,62.45 U$6.3
N$42
  Top 0.508: R35.2 R36.1 22.95,44.23 22.35,44.83 19.81,44.83 19.5,44.52 U$7.4
N$43
  Top 0.356: U$2.16 39.35,37.61 | 39.35,37.61 38.93,38.03 38.98,38.08 38.98,38.09 39.46,37.61 40.4,37.61 | 39.96,37.61 39.35,37.61 | 38.89,37.96 39.25,37.61 39.35,37.61 | 39.35,37.61
  Top 0.508: 26.29,62.4 R31.2 26.25,63.46 26.91,64.12 C41.1 32.27,64.12 35.31,61.09 35.31,49.4 38.86,45.85 38.86,38.1 38.93,38.03 39.12,37.85
N$44
  Top 0.508: R5.1 17.91,56.01 18.8,55.12 22.16,55.12 22.35,55.12 | U$10.1 23.82,54.67 | 23.82,54.67 24.13,54.36 | U$10.4 24.45,52.77 24.13,53.09 24.13,54.36 | U$9.3 30.03,58.99 29.72,58.67 29.72,56.39 29.21,55.88 25.02,55.88 23.82,54.67 | R11.1 U$10.1 | 22.35,55.12 22.8,54.67 U$10.1 | 24.13,54.36 24.13,54.99 | 22.35,55.12 22.92,55.12
N$45
  Top 0.508: U$14.1 46.87,5.54 C44.1
N$46
  Top 0.508: R32.1 27.81,62.36 29.34,60.83 R23.2 30.99,60.83 33.02,58.8 33.02,57.28 32.38,56.64 31.32,56.64 U$9.1
N$47
  Top 0.508: U$14.6 46.87,7.29 C44.2 | D2.1 C44.2 | C44.2 43.85,7.29 L5.P$1
N$48
  Top 0.508: R22.2 R23.1 28.57,59.99 U$9.4
N$50
  Top 0.508: R33.1 49.55,5.56 U$14.3 49.15,5.08 49.15,4.83 49.78,4.19 50.39,4.19 R34.2
N$51  (via drill 0.3)
  Top 0.305: U$2.14 47.21,38.26 47.56,38.61 v47.56,44.7 R38.1
  Bottom 0.305: X2.6 48.77,45.91 v47.56,44.7
N$52  (via drill 0.3)
  Top 0.305: U$2.13 47.58,37.61 48.26,38.29 v48.26,43.12 R39.1
  Bottom 0.305: X2.5 49.78,44.64 v48.26,43.12
N$53
  Top 0.305: U$2.3 47.25,31.11 47.56,30.8 47.56,29.97 49.78,27.75 54.8,27.75 55.28,27.27 X3.6
N$54
  Top 0.305: U$2.5 48.11,32.41 48.7,31.81 48.7,30.61 50.42,28.89 53.59,28.89 54.52,29.81 X3.4
N$55
  Top 0.305: U$2.4 47.93,31.76 48.13,31.56 48.13,30.29 50.1,28.32 53.91,28.32 54.13,28.54 X3.5
N$56  (via drill 0.3)  (2 unrouted)
  Top 0.508: U$14.4 U$14.5 48.2,8.77 C46.1
  Bottom 0.711: U$15.P$1 50.8,5.84 | 50.8,5.84 49.91,5.84 | 49.91,5.84 47.37,8.38 v47.37,8.95 v47.37,9.71 v47.88,9.71 47.88,8.76 50.42,6.22 | 50.42,6.22 50.8,5.84 | 49.91,5.84 50.29,5.46 54.23,5.46 54.23,6.22 50.42,6.22
  other vias: 47.88,8.95
N$57
  Top 0.305: U$2.7 48.46,33.71 49.85,32.32 49.85,31.34 50.32,30.86 53.82,30.86 X3.1
N$58
  Top 0.305: U$2.6 48.28,33.06 49.28,32.07 49.28,30.99 50.39,29.88 R37.2 50.48,29.88
N$59
  Top 0.305: R37.1 53.69,29.88 54.9,31.08 X3.3
N$61
  Top 0.305: R41.2 42.49,22.35 | 42.49,22.35 R40.1 | IC4.2 42.67,22.17 42.66,22.18 | 42.66,22.18 42.49,22.35 | 42.66,22.18 42.69,22.18 42.86,22.35 | 42.66,22.18
N$64
  Top 0.305: C1.2 40.13,19.61 IC4.4
V+  (via drill 0.3)
  Top 0.305: C3.2 41.03,38.26 U$2.15
  Top 0.508: v41.02,43.81 41.02,41.95 C2.2 C3.2 | 30.86,55.37 v31.24,55.75 v30.48,55.75 30.86,55.37 | 30.86,55.37 R19.2 | 30.86,38.86 v31.24,39.24 v30.48,39.24 30.86,38.86 | 30.86,38.86 R18.2
  Bottom 0.508: v30.48,55.75 32.77,55.75 41.02,47.5 v41.02,43.81 37.72,43.81 33.15,39.24 v30.48,39.24 v31.24,39.24
VCC  (via drill 0.3)  (1 unrouted)
  Top 0.305: IC4.5 40.13,16.51 40.89,17.27 43.18,17.27 43.94,16.51 IC4.8 | IC1.5 51.18,16.51 51.94,17.27 54.23,17.27 54.99,16.51 IC1.8
  Top 0.508: L5.P$2 40.35,9.71 C45.1 40.32,10.29 40.32,11.11 41.47,12.25 49.34,12.25 51.62,9.97 51.62,8.28 R33.2
  Top 0.61: C48.1 43.94,14.75 IC4.8 | IC1.8 arc90 55.17,14.75 C51.1
  Top 0.711: v38.86,10.29 v38.86,9.02 40.07,9.02 40.07,9.97 | 39.37,9.65 v38.23,9.65 | 38.8,9.08 v38.23,9.65 | v38.23,9.65 v38.86,10.29 | v38.86,10.29 40.32,10.29 | v46.61,15.11 46.24,14.75 C48.1 46.28,14.75 v46.61,14.41 46.86,14.41 47.18,14.73 46.8,15.11 46.74,15.11 | C51.1 57.29,14.75 | 57.29,14.75 v57.66,15.11 57.92,15.11 v58.26,14.78 | v58.26,14.77 57.91,14.41 v57.66,14.41 57.33,14.75 57.29,14.75
  Bottom 0.711: v46.61,14.41 41.66,14.41 38.86,11.62 v38.86,9.02 v38.23,9.65 38.23,11.94 41.4,15.11 v46.61,15.11 | v47.21,14.76 46.86,15.11 v46.61,15.11 | v46.61,14.41 46.87,14.41 47.2,14.75 | v46.61,15.11 57.92,15.11 v58.26,14.78 57.9,14.41 v46.61,14.41

### Text on the board
Top: Audio Interface | 12.2017 | V1.0 | I1 | I2 | O1 | O2